# EasyEDA Pro project AcGunV2-2.eprj

# Schematic Schematic1
Create Date: 2022-12-29; Page Name: P1; Project Name: AcGunV2-2; Schematic Name: Schematic1; Update Date: 2022-12-29
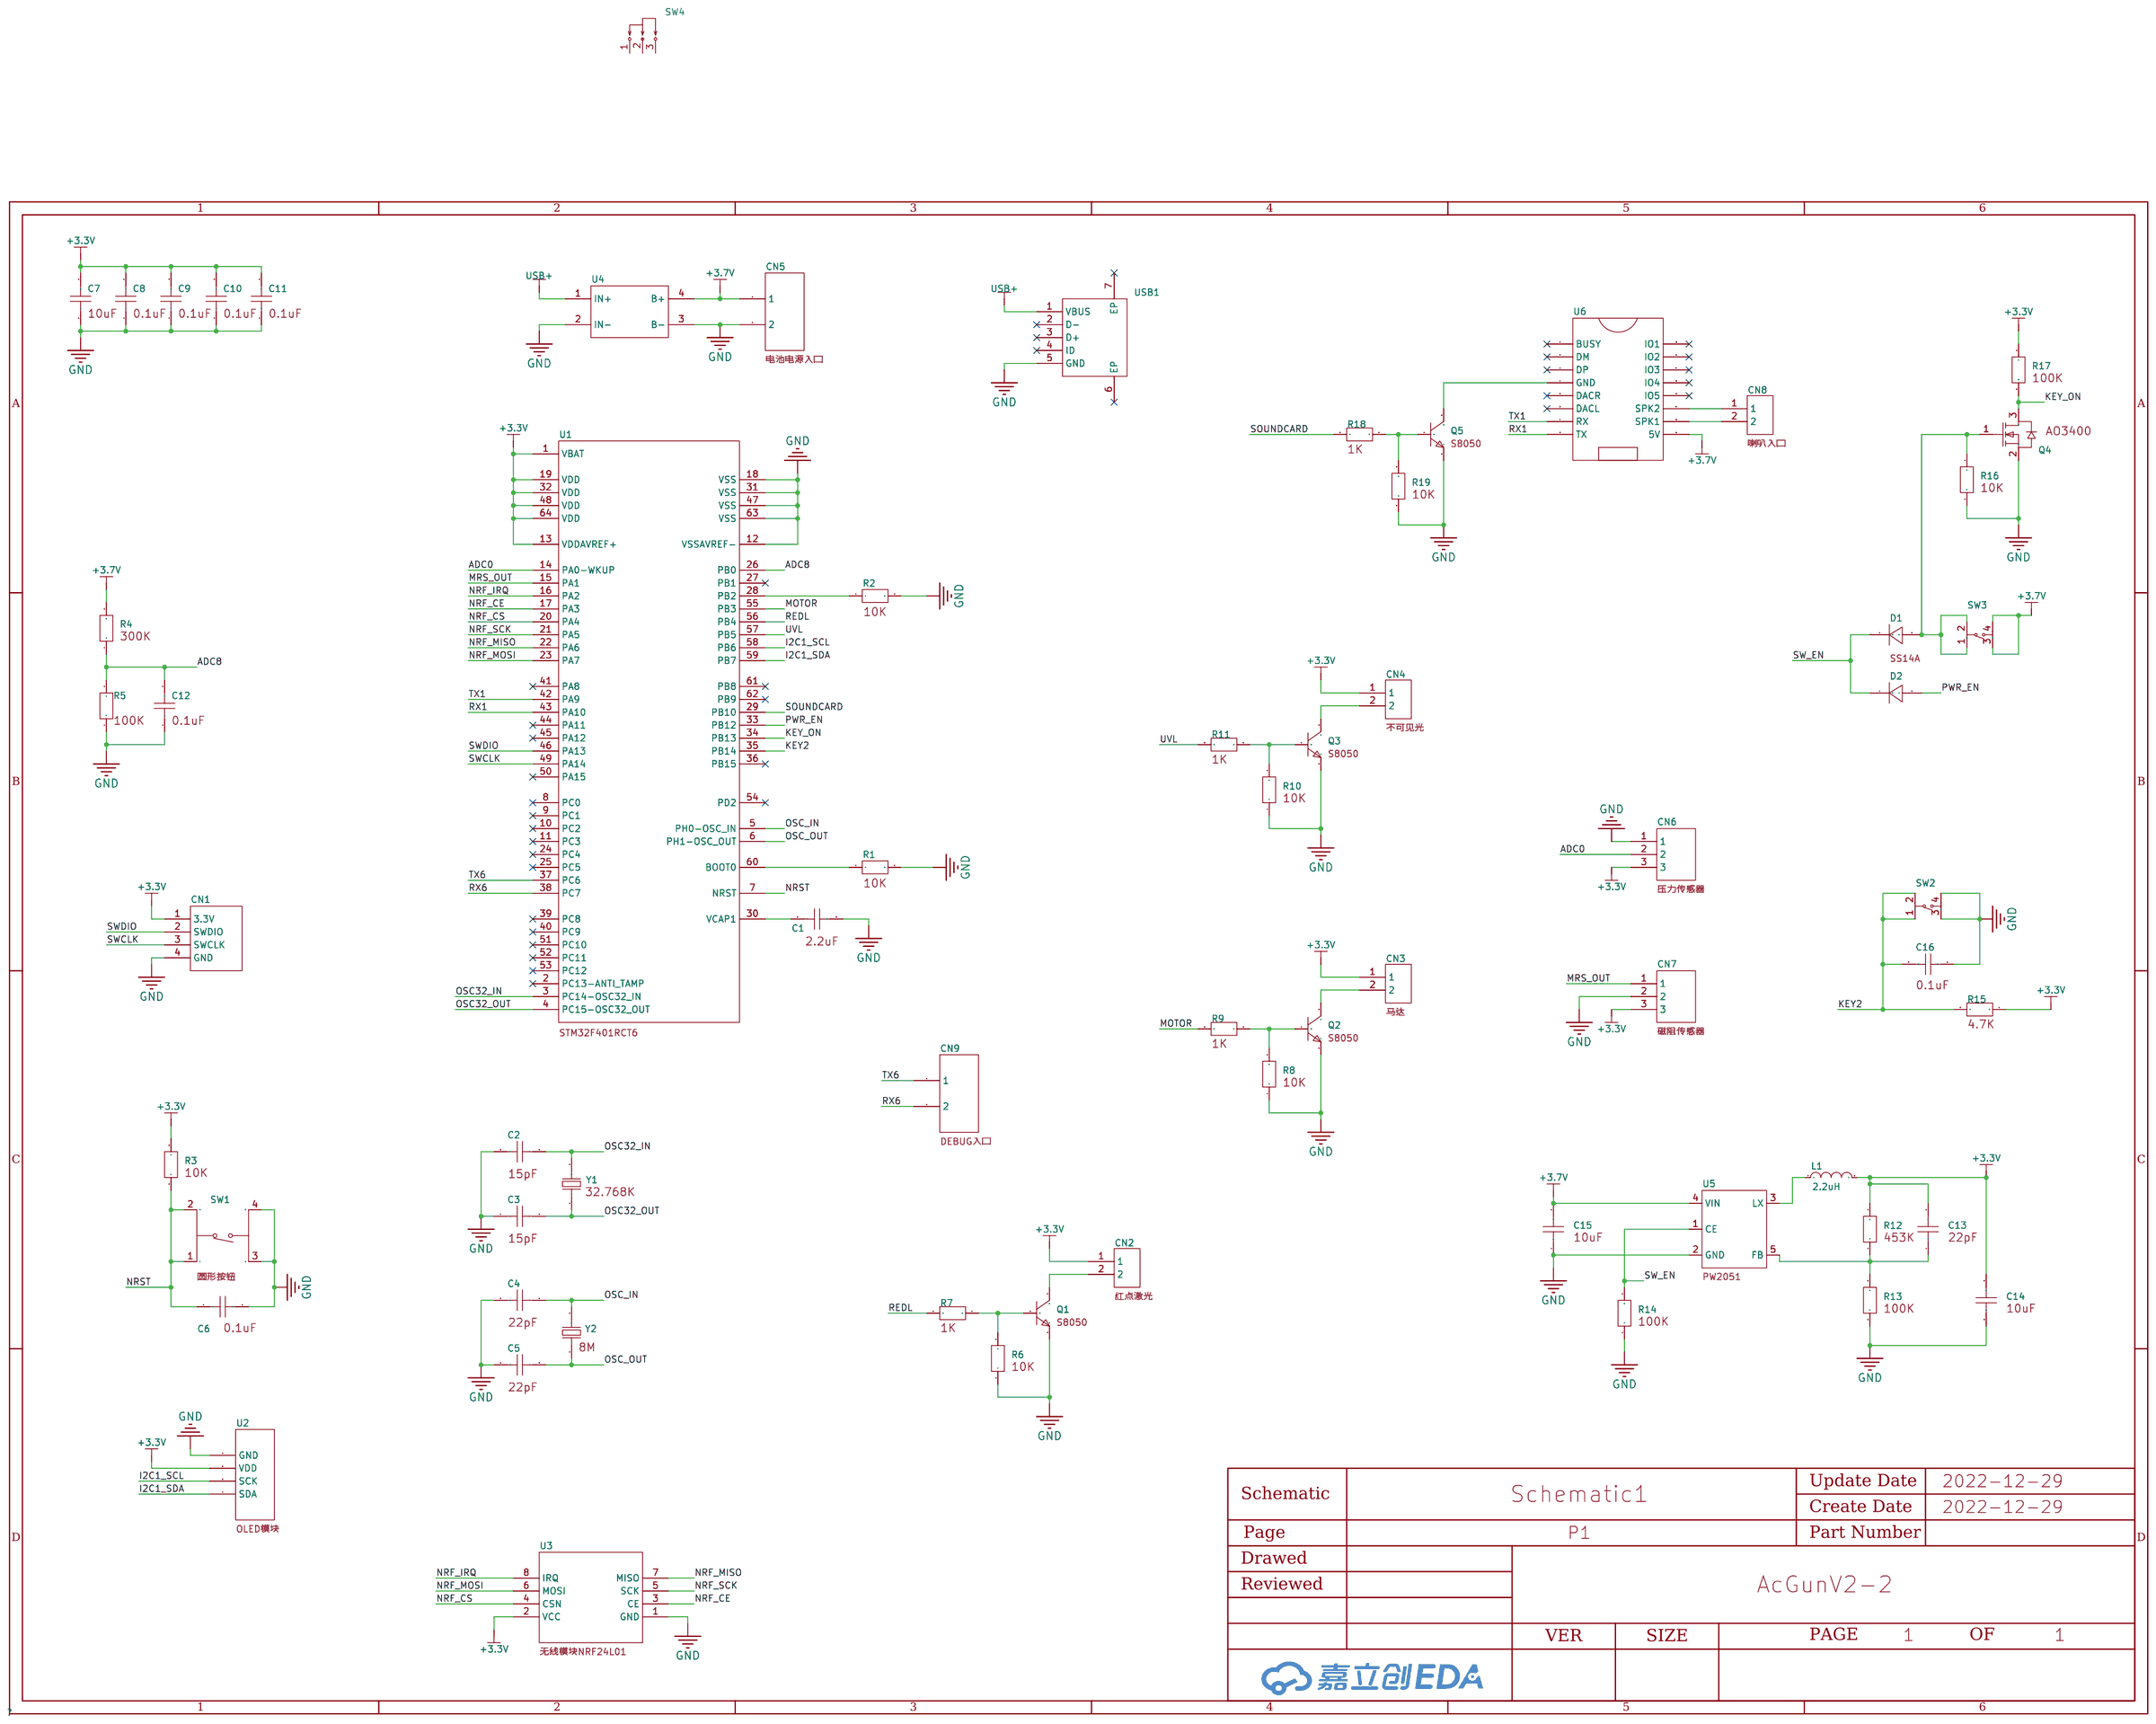
[diagram p0: schematic sheet]

## Parts
C1  -  [0603]
C2  -  [0603]
C3  -  [0603]
C4  -  [0603]
C5  -  [0603]
C6  -  [0603]
C7  -  [0603]
C8  -  [0603]
C9  -  [0603]
C10  -  [0603]
C11  -  [0603]
C12  -  [0603]
C13  -  [0603]
C14  -  [0603]
C15  -  [0603]
C16  -  [0603]
CN1  -  [烧录入口]
CN2  -  [2P接线点]
CN3  -  [2P接线点]
CN4  -  [2P接线点]
CN5  -  [XH2.54插件2P]
CN6  -  [3P接线点]
CN7  -  [3P接线点]
CN8  -  [2P接线点]
CN9  -  [XH2.54插件2P]
D1  SS14A  [SMA_L4.3-W2.6-LS5.2-RD]
D2  SS14A  [SMA_L4.3-W2.6-LS5.2-RD]
L1  2.2uH  [IND-SMD_L4.0-W4.0_0.47UH04209.5A]
Q1  S8050  [SOT-23_L2.9-W1.3-P1.90-LS2.4-BR]
Q2  S8050  [SOT-23_L2.9-W1.3-P1.90-LS2.4-BR]
Q3  S8050  [SOT-23_L2.9-W1.3-P1.90-LS2.4-BR]
Q4  AO3400  [SOT-23_L2.9-W1.3-P1.90-LS2.4-BR]
Q5  S8050  [SOT-23_L2.9-W1.3-P1.90-LS2.4-BR]
R1  -  [0603]
R2  -  [0603]
R3  -  [0603]
R4  -  [0603]
R5  -  [0603]
R6  -  [0603]
R7  -  [0603]
R8  -  [0603]
R9  -  [0603]
R10  -  [0603]
R11  -  [0603]
R12  -  [0603]
R13  -  [0603]
R14  -  [0603]
R15  -  [0603]
R16  -  [0603]
R17  -  [0603]
R18  -  [0603]
R19  -  [0603]
SW1  1TS001G-2700-1500-CT  [SW-SMD_4P-L5.1-W5.1-P3.70-LS6.5-TL-2]
SW2  -  [按钮开关]
SW3  -  [按钮开关]
SW4  SS12D10G4 071  [SW-TH_SHOU-HAN_SS12D10G4]
U1  STM32F401RCT6  [LQFP-64_L10.0-W10.0-P0.50-LS12.0-BL]
U2  -  [OLED模块封装]
U3  -  [NRF24L01]
U4  -  [TP4056M]
U5  -  [SOT-23-5_L2.9-W1.6-P0.95-LS2.8-BR]
U6  -  [MY2480]
USB1  -  [MICRO-USB-TH_MICRO-USB-A14]
Y1  -  [3215]
Y2  -  [5032]

## Library data of the parts
C1 = 电容: 0603 标准贴片电容; Capacitance: 2.2uF
C2 C3 = 电容: 0603 标准贴片电容; Capacitance: 15pF
C4 C5 C13 = 电容: 0603 标准贴片电容; Capacitance: 22pF
C6 C8-C12 C16 = 电容: 0603 标准贴片电容; Capacitance: 0.1uF
C7 C14 C15 = 电容: 0603 标准贴片电容; Capacitance: 10uF
CN1 = 烧录入口
CN2 = 2P接线点: 红点激光
CN3 = 2P接线点: 马达
CN4 = 2P接线点: 不可见光
CN5 = XH2.54插件2P: 电池电源入口
CN6 = 3P接线点: 压力传感器
CN7 = 3P接线点: 磁阻传感器
CN8 = 2P接线点: 喇叭入口
CN9 = XH2.54插件2P: DEBUG入口
D1 D2 = SS14A: 直流反向耐压(Vr):40V;平均整流电流(Io):1A;正向压降(Vf):500mV@1A;; LCSC Part Name: 40V 1A 500mV@1A; Supplier Part: C211770; Manufacturer: YANGJIE(扬杰); Supplier Footprint: SMA(DO-214AC); JLCPCB Part Class: Extended Part; Datasheet: https://atta.szlcsc.com/upload/public/pdf/source/20180504/C211770_627C435F34E9C107E4A4301F69D28675.pdf; Supplier: LCSC; Reverse Voltage (Vr): 40V; Average Rectified Current (Io): 1A; Forward Voltage (Vf@If): 500mV@1A
L1 = 2.2uh3a电感: 电感值:2.2uH;精度:±20%;额定电流:3A;直流电阻(DCR):-;; Rated Current: 3A; Supplier: LCSC; Supplier Part: C438930; Supplier Footprint: SMD; LCSC Part Name: 2.2uH ±20% 3A; Tolerance: ±20%; Manufacturer: Cybermax(思博科技); Manufacturer Part: CMLO0420H2R2MTT
Q1-Q3 Q5 = S8050: 晶体管类型:NPN;集射极击穿电压(Vceo):25V;集电极电流(Ic):500mA;功率(Pd):625mW;集电极-发射极饱和电压(VCE(sat)@Ic,Ib):600mV@500mA,50mA;直流电流增益(hFE@Ic,Vce):200@100mA,1V;特征频率(fT):150MHz;工作温度:+150@(Tj);; LCSC Part Name: NPN 25V 500mA; Supplier Part: C414195; Manufacturer: GP(格瑞宝); Supplier Footprint: SOT-23; JLCPCB Part Class: Extended Part; Datasheet: https://atta.szlcsc.com/upload/public/pdf/source/20190828/C414195_F420B1E456405127F3181AB0586AEC6F.pdf; Supplier: LCSC; Transistor Type: NPN; Collector-Emitter Breakdown Voltage (Vceo): 25V; Collector Current (Ic): 500mA; Power Dissipation (Pd): 625mW; Collector-Emitter Saturation Voltage (VCE(sat)@Ic,Ib): 600mV@500mA,50mA; DC Current Gain (hFE@Ic,Vce): 200@100mA,1V; Transition Frequency (fT): 150MHz; Operating Temperature: +150@(Tj)
Q4 = AO3400: 类型:N沟道;漏源电压(Vdss):30V;连续漏极电流(Id):5.8A;功率(Pd):1.5W;导通电阻(RDS(on)@Vgs,Id):35mΩ@10V,5.8A;阈值电压(Vgs(th)@Id):1.2V@250uA;栅极电荷(Qg@Vgs):-;输入电容(Ciss@Vds):1050pF@15V;反向传输电容(Crss@Vds):77pF@15V;工作温度:+150@(Tj);; LCSC Part Name: N沟道 30V 5.8A; Supplier Part: C2938367; Manufacturer: GOODWORK(固得沃克); Supplier Footprint: SOT23; JLCPCB Part Class: Extended Part; Datasheet: https://atta.szlcsc.com/upload/public/pdf/source/20211229/1DE691E24B5B31BB262C463D0489A9AB.pdf; Supplier: LCSC; Type: N沟道; Drain Source Voltage (Vdss): 30V; Continuous Drain Current (Id): 5.8A; Power Dissipation (Pd): 1.5W; Drain Source On Resistance (RDS(on)@Vgs,Id): 35mΩ@10V,5.8A; Gate Threshold Voltage (Vgs(th)@Id): 1.2V@250uA; Input Capacitance (Ciss@Vds): 1050pF@15V; Reverse Transfer Capacitance (Crss@Vds): 77pF@15V; Operating Temperature: +150@(Tj)
R1-R3 R6 R8 R10 R16 R19 = 电阻: 0603 标准贴片电阻; Resistance: 10K
R4 = 电阻: 0603 标准贴片电阻; Resistance: 300K
R5 R13 R14 R17 = 电阻: 0603 标准贴片电阻; Resistance: 100K
R7 R9 R11 R18 = 电阻: 0603 标准贴片电阻; Resistance: 1K
R12 = 电阻: 0603 标准贴片电阻; Resistance: 453K
R15 = 电阻: 0603 标准贴片电阻; Resistance: 4.7K
SW1 = 1TS001G-2700-1500-CT: 触点电流:20mA;额定电压(DC):12V;电路结构:单刀单掷;安装方式:立贴;按钮形状:圆形按钮;带灯:-;开关长度:5.1mm;开关宽度:5.1mm;开关高度:0.3mm;; LCSC Part Name: 铜头按钮; Supplier Part: C318800; Manufacturer: HYP(鸿源精密); Supplier Footprint: SMD,5.1x5.1mm; JLCPCB Part Class: Extended Part; Datasheet: https://atta.szlcsc.com/upload/public/pdf/source/20200109/C318800_E3EE45BECD3EEEC6701309AC007B685B.pdf; Supplier: LCSC; Contact Current: 20mA; Voltage Rating (DC): 12V; Circuit: 单刀单掷; Mounting Style: 立贴; Actuator Style: 圆形按钮; Switch Length: 5.1mm; Switch Width: 5.1mm; Switch Height: 0.3mm
SW2 SW3 = 按键开关
SW4 = SS12D10G4 071: 立式两档拨动,单排3脚插件,12.7x6.7x6.4,黑柄4MM; Supplier Part: C2887259; Manufacturer: SHOU HAN(首韩); Supplier Footprint: 插件; JLCPCB Part Class: Extended Part; Datasheet: https://atta.szlcsc.com/upload/public/pdf/source/20210820/80D1704BBF3FCEE0435FCAA54C61E0A3.pdf; Supplier: LCSC
U1 = STM32F401RCT6: 主频（MAX):84MHz;工作电压:1.7V ~ 3.6V;; Supplier Part: C74524; Manufacturer: ST(意法半导体); Supplier Footprint: LQFP-64_10x10x05P; JLCPCB Part Class: Extended Part; Datasheet: https://atta.szlcsc.com/upload/public/pdf/source/20170728/C74524_1501225886278849063.pdf; Supplier: LCSC; Speed: 84MHz; Voltage - Supply (Vcc/Vdd): 1.7V ~ 3.6V; Program Memory Size: 256KB; RAM Size: 64KB; Number of I/O: 50; A/D: 16x12bit; PWM: 32; UART/USART: 3 USART; SPI: 3; I2C（SMBUS/PMBUS）: 2; USB Device: 1; USB Host/OTG: 1
U2 = 长型OLED屏幕: OLED模块
U3 = NRF24L01: 无线模块NRF24L01
U4 = TP4056M
U5 = PW2051: Supplier: LCSC; Supplier Part: C9900004763; Supplier Footprint: SOT23-5; JLCPCB Part Class: Extended Part; Datasheet: 2021-12-24/856123Z/fbe1facec1e64a42b88c21fe7c936e8d/PW2051.pdf
U6 = MY2480: MY2480发声模块
USB1 = 立式USB插口: 连接器类型:Micro-B;标准:USB 2.0;公母:母座;触点数量:5;端口数量:1;; Supplier: LCSC; Supplier Part: C145795; Supplier Footprint: 插件; JLCPCB Part Class: Extended Part; LCSC Part Name: Micro-B 母座; Datasheet: https://atta.szlcsc.com/upload/public/pdf/source/20190321/C145795_7870B82BC79666CAD2740B4BEFFA2B3B.pdf; Manufacturer: 韩国韩荣; Manufacturer Part: U-D-M5DD-W-1; Connector Type: Micro-B; Gender: 母座; Number of Contacts: 5; Number of Ports: 1; Standard: USB 2.0
Y1 = 32.768KHz晶振: Frequency: 32.768K
Y2 = 8MHz晶振: Capacitance: 8M

## Nets
+3.3V: C7.2 C8.2 C9.2 C10.2 C11.2 C13.2 C14.2 CN1.1(3.3V) CN2.1 CN3.1 CN4.1 CN6.3 CN7.3 L1.2 R3.2 R12.2 R15.1 R17.1 U1.1(VBAT) U1.13(VDDAVREF+) U1.19(VDD) U1.32(VDD) U1.48(VDD) U1.64(VDD) U2.2(VDD) U3.2(VCC)
+3.7V: C15.2 CN5.1 R4.2 SW3.3(C) SW3.4(D) U4.4(B+) U5.4(VIN) U6.9(5V)
GND: C1.2 C2.1 C3.1 C4.1 C5.1 C6.2 C7.1 C8.1 C9.1 C10.1 C11.1 C12.1 C14.1 C15.1 C16.1 CN1.4(GND) CN5.2 CN6.1 CN7.2 Q1.2(E) Q2.2(E) Q3.2(E) Q4.2(S) Q5.2(E) R1.2 R2.2 R5.1 R6.1 R8.1 R10.1 R13.1 R14.1 R16.2 R19.1 SW1.3(C) SW1.4(D) SW2.3(C) SW2.4(D) U1.12(VSSAVREF-) U1.18(VSS) U1.31(VSS) U1.47(VSS) U1.63(VSS) U2.1(GND) U3.1(GND) U4.2(IN-) U4.3(B-) U5.2(GND) USB1.5(GND)
ADC0: CN6.2 U1.14(PA0-WKUP)
ADC8: C12.2 R4.1 R5.2 U1.26(PB0)
I2C1_SCL: U1.58(PB6) U2.3(SCK)
I2C1_SDA: U1.59(PB7) U2.4(SDA)
KEY2: C16.2 R15.2 SW2.1(A) SW2.2(B) U1.35(PB14)
KEY_ON: Q4.3(D) R17.2 U1.34(PB13)
MOTOR: R9.2 U1.55(PB3)
MRS_OUT: CN7.1 U1.15(PA1)
NRF_CE: U1.17(PA3) U3.3(CE)
NRF_CS: U1.20(PA4) U3.4(CSN)
NRF_IRQ: U1.16(PA2) U3.8(IRQ)
NRF_MISO: U1.22(PA6) U3.7(MISO)
NRF_MOSI: U1.23(PA7) U3.6(MOSI)
NRF_SCK: U1.21(PA5) U3.5(SCK)
NRST: C6.1 R3.1 SW1.1(A) SW1.2(B) U1.7(NRST)
OSC32_IN: C2.2 U1.3(PC14-OSC32_IN) Y1.2
OSC32_OUT: C3.2 U1.4(PC15-OSC32_OUT) Y1.1
OSC_IN: C4.2 U1.5(PH0-OSC_IN) Y2.2
OSC_OUT: C5.2 U1.6(PH1-OSC_OUT) Y2.1
PWR_EN: D2.2(A) U1.33(PB12)
REDL: R7.2 U1.56(PB4)
RX1: U1.43(PA10) U6.8(TX)
RX6: CN9.2 U1.38(PC7)
SOUNDCARD: R18.2 U1.29(PB10)
SW_EN: D1.1(C) D2.1(C) R14.2 U5.1(CE)
SWCLK: CN1.3(SWCLK) U1.49(PA14)
SWDIO: CN1.2(SWDIO) U1.46(PA13)
TX1: U1.42(PA9) U6.7(RX)
TX6: CN9.1 U1.37(PC6)
USB+: U4.1(IN+) USB1.1(VBUS)
UVL: R11.2 U1.57(PB5)
Net-(C1-1): C1.1 U1.30(VCAP1)
Net-(C13-1): C13.1 R12.1 R13.2 U5.5(FB)
Net-(CN2-2): CN2.2 Q1.3(C)
Net-(CN3-2): CN3.2 Q2.3(C)
Net-(CN4-2): CN4.2 Q3.3(C)
Net-(CN8-1): CN8.1 U6.11(SPK2)
Net-(CN8-2): CN8.2 U6.10(SPK1)
Net-(D1-2): D1.2(A) Q4.1(G) R16.1 SW3.1(A) SW3.2(B)
Net-(L1-1): L1.1 U5.3(LX)
Net-(Q1-1): Q1.1(B) R6.2 R7.1
Net-(Q2-1): Q2.1(B) R8.2 R9.1
Net-(Q3-1): Q3.1(B) R10.2 R11.1
Net-(Q5-1): Q5.1(B) R18.1 R19.2
Net-(Q5-3): Q5.3(C) U6.4(GND)
Net-(R1-1): R1.1 U1.60(BOOT0)
Net-(R2-1): R2.1 U1.28(PB2)

Not connected (* = marked no-connect by the designer): SW4 1 2 3; U1 2(PC13-ANTI_TAMP)* 8(PC0)* 9(PC1)* 10(PC2)* 11(PC3)* 24(PC4)* 25(PC5)* 27(PB1)* 36(PB15)* 39(PC8)* 40(PC9)* 41(PA8)* 44(PA11)* 45(PA12)* 50(PA15)* 51(PC10)* 52(PC11)* 53(PC12)* 54(PD2)* 61(PB8)* 62(PB9)*; U6 1(BUSY)* 2(DM)* 3(DP)* 5(DACR)* 6(DACL)* 12(IO5)* 13(IO4)* 14(IO3)* 15(IO2)* 16(IO1)*; USB1 2(D-)* 3(D+)* 4(ID)* 6(EP)* 7(EP)*
